# Altium project STM32F103ZET6最小系统V2.PrjPCB
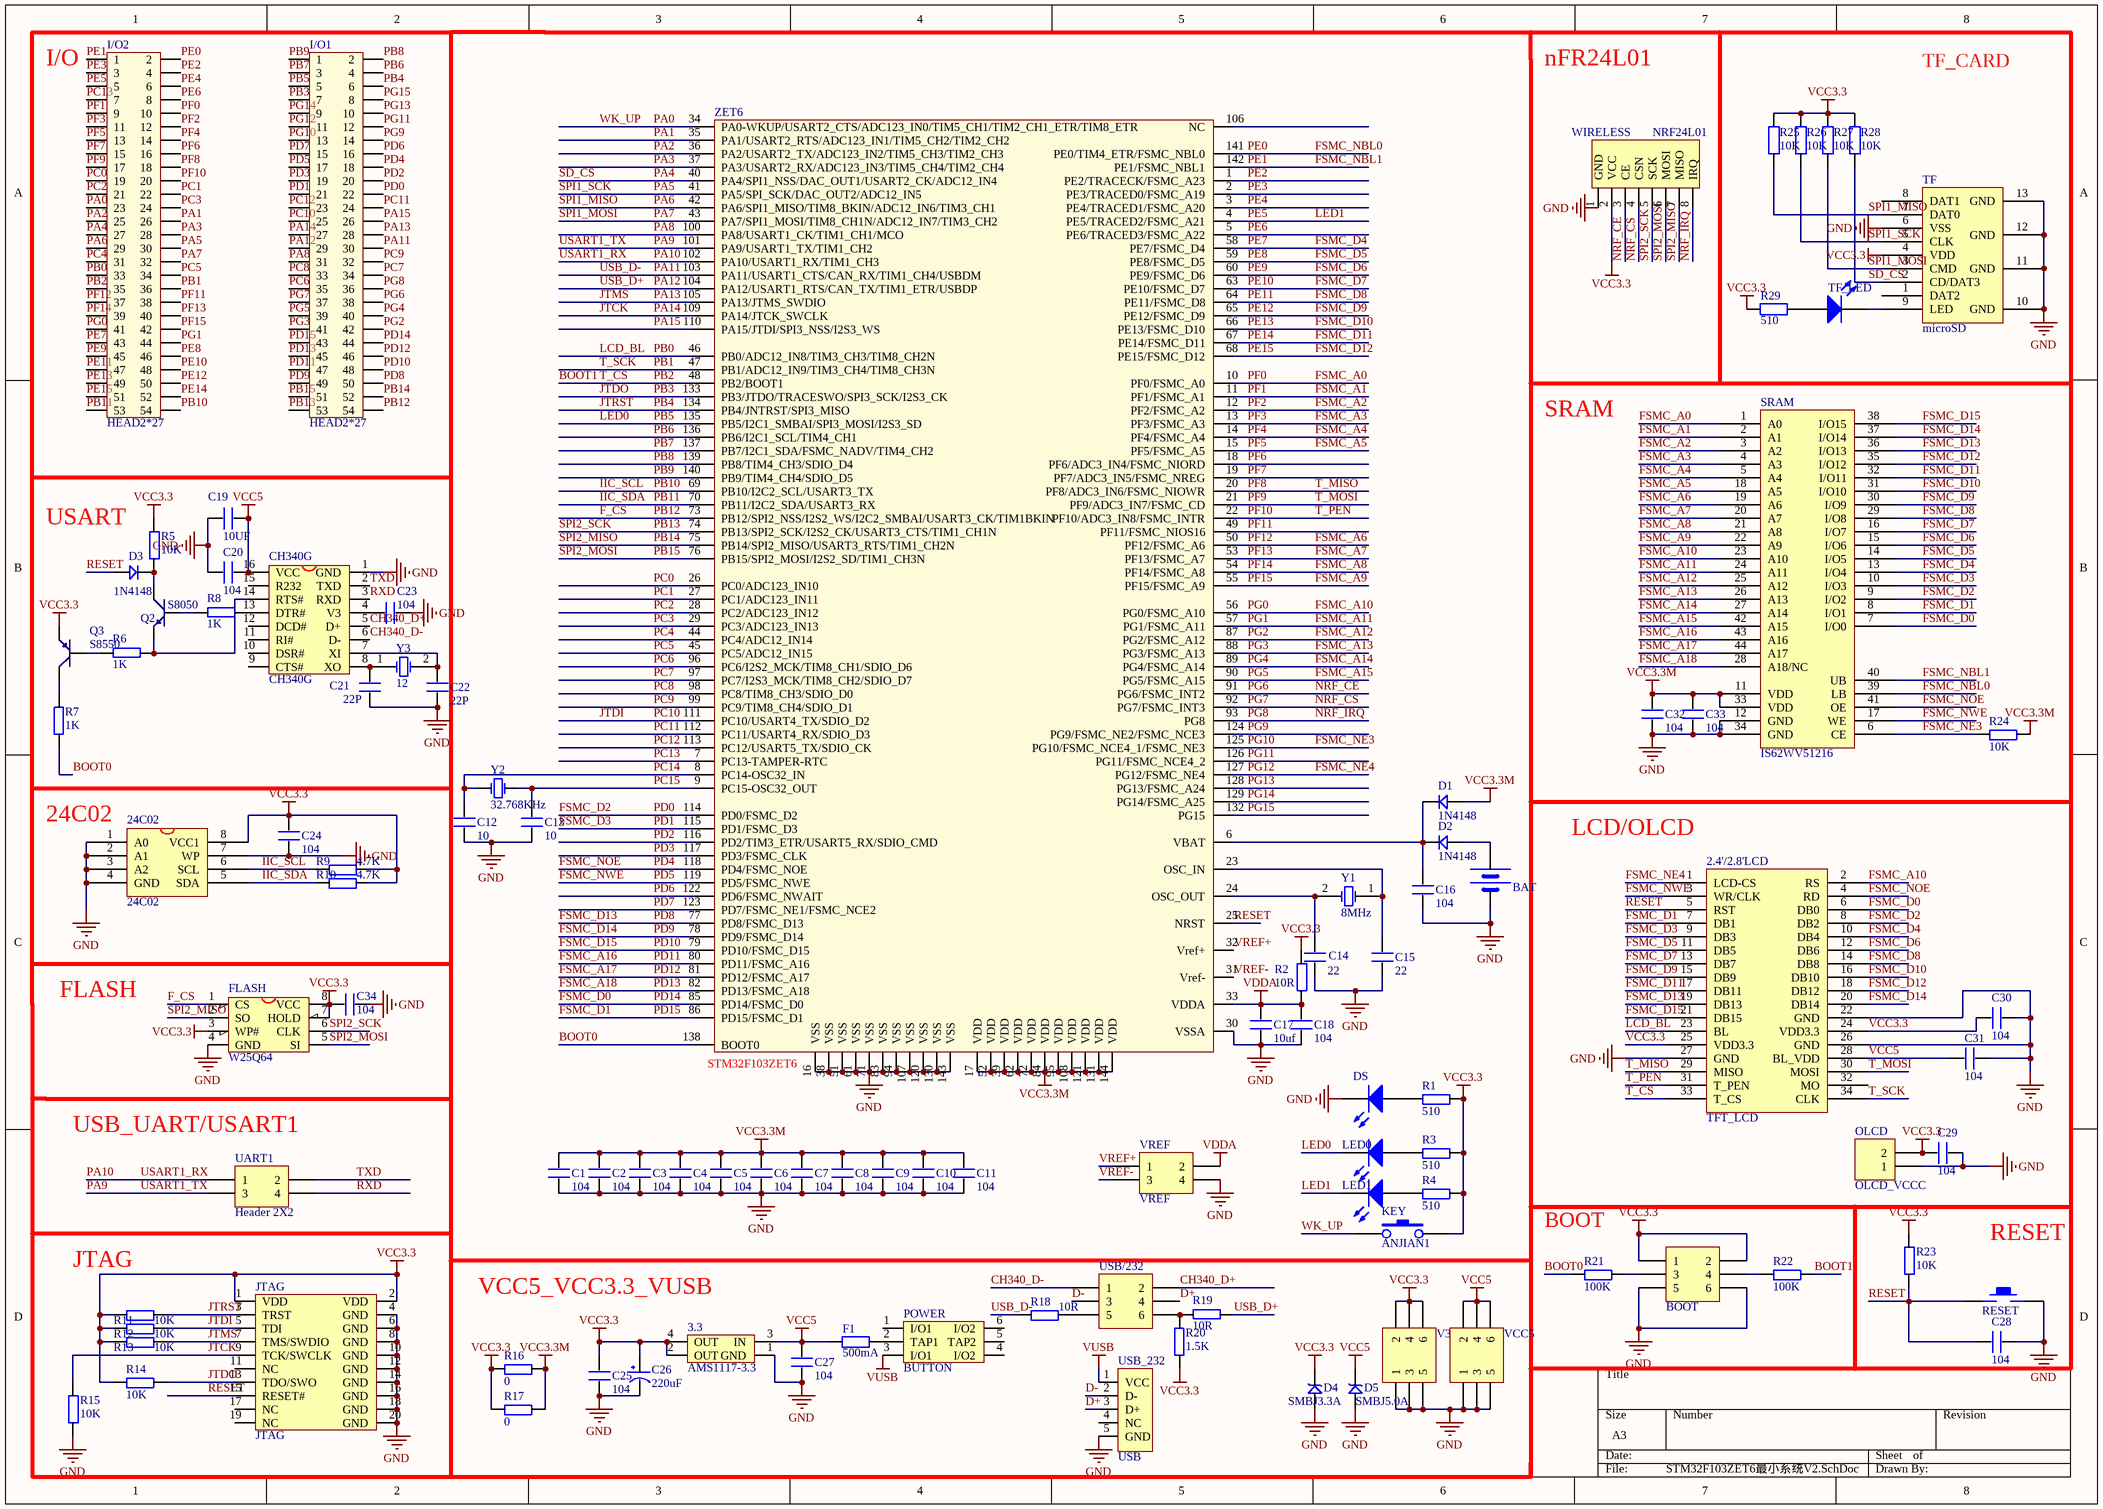
[diagram p0: STM32F103ZET6最小系统V2.SchDoc]
1 sheet, 102 parts. Net scope: global (net labels, ports and power ports of the same name join across sheets).
Board file: STM32F103ZET6最小系统V2.PcbDoc

## Sheet STM32F103ZET6最小系统V2.SchDoc
size A3

### Parts
2.4'/2.8'LCD  TFT_LCD  [DB2*17]
3.3  AMS1117-3.3  [AMS1117]
24C02  24C02  [SOP-8]
BAT  BATT  [BATM]  (value not drawn)
BOOT  Header 3X2  [HDR2X3]  (value not drawn)
C1  104  [0603P]
C2  104  [0603P]
C3  104  [0603P]
C4  104  [0603P]
C5  104  [0603P]
C6  104  [0603P]
C7  104  [0603P]
C8  104  [0603P]
C9  104  [0603P]
C10  104  [0603P]
C11  104  [0603P]
C12  10  [0603P]
C13  10  [0603P]
C14  22  [0805]
C15  22  [0805]
C16  104  [0805]
C17  10uf  [0805]
C18  104  [0603P]
C19  10UF  [0805]
C20  104  [0805]
C21  22P  [0805]
C22  22P  [0805]
C23  104  [0805]
C24  104  [0805]
C25  104  [0805]
C26  220uF  [CC6.56.5]
C27  104  [0805]
C28  104  [0805]
C29  104  [0805]
C30  104  [0805]
C31  104  [0805]
C32  104  [0805]
C33  104  [0805]
C34  104  [0805]
CH340G  CH340G  [SOP16M]
D1  1N4148  [DIODE_SOP]
D2  1N4148  [DIODE_SOP]
D3  1N4148  [DIODE_SOP]
D4  SMBJ5.0A  [SMBJ]
D5  SMBJ3.3A  [SMBJ]
DS  LED1  [0805]  (value not drawn)
F1  value 500mA  [0805]  (hidden comment: Res2)
FLASH  W25Q64  [SOIC-8]
I/O1  HEAD2*27  [HEAD2*27]
I/O2  HEAD2*27  [HEAD2*27]
JTAG  JTAG  [HDR2X10]
KEY  ANJIAN1  [贴片微动开关]
LED0  LED1  [0805]  (value not drawn)
LED1  LED1  [0805]  (value not drawn)
OLCD  OLCD_VCCC  [HDR1X2]
POWER  BUTTON  [BTN8.5*8.5]
Q2  S8050  [SOT-23R]
Q3  S8550  [SOT-23R]
R1  510  [0805]
R2  10R  [0805]
R3  510  [0805]
R4  510  [0805]
R5  10K  [0805]
R6  1K  [0805]
R7  1K  [0805]
R8  1K  [0805]
R9  4.7K  [0805]
R10  4.7K  [0805]
R11  10K  [0805]
R12  10K  [0805]
R13  10K  [0805]
R14  10K  [0805]
R15  10K  [0805]
R16  0  [0805]
R17  0  [0805]
R18  10R  [0805]
R19  10R  [0805]
R20  1.5K  [0805]
R21  100K  [0805]
R22  100K  [0805]
R23  10K  [0805]
R24  10K  [0805]
R25  value 10K  [0805]  (hidden comment: Res2)
R26  value 10K  [0805]  (hidden comment: Res2)
R27  value 10K  [0805]  (hidden comment: Res2)
R28  value 10K  [0805]  (hidden comment: Res2)
R29  value 510  [0805]  (hidden comment: Res2)
RESET  KEY_M  [贴片微动开关]  (value not drawn)
SRAM  IS62WV51216  [TSOP44]
TF  microSD  [TF_CARD]
TF_LED  LED1  [0805]  (value not drawn)
UART1  Header 2X2  [HDR2X2]
USB/232  Header 3X2  [HDR2X3]  (value not drawn)
USB_232  USB  [USB/SM0.8-6H5]
V3.3  Header 3X2  [HDR2X3]  (value not drawn)
VCC5  Header 3X2  [HDR2X3]  (value not drawn)
VREF  VREF  [HDR2X2]
WIRELESS  NRF24L01  [NRF24L01]
Y1  8MHz  [XTAL_US]
Y2  32.768KHz  [XTAL32]
Y3  12  [XTAL_US]
ZET6  STM32F103ZET6  [LQFP144]

### Nets
GND: 2.4'/2.8'LCD.22(GND) 2.4'/2.8'LCD.26(GND) 2.4'/2.8'LCD.27(GND) 3.3.1(GND) 24C02.1(A0) 24C02.2(A1) 24C02.3(A2) 24C02.4(GND) 24C02.7(WP) BAT.2(GND) BOOT.5 BOOT.6 C1.1 C2.1 C3.1 C4.1 C5.1 C6.1 C7.1 C8.1 C9.1 C10.1 C11.1 C12.1 C13.1 C14.1 C15.1 C16.1 C17.1 C18.1 C19.1 C20.1 C21.1 C22.1 C23.2 C24.1 C25.1 C26.2(GND) C27.1 C28.2 C29.1 C30.2 C31.2 C32.1 C33.1 C34.1 CH340G.1(GND) D4.1 D5.1 DS.2(K) FLASH.4(GND) JTAG.4(GND) JTAG.6(GND) JTAG.8(GND) JTAG.10(GND) JTAG.12(GND) JTAG.14(GND) JTAG.16(GND) JTAG.18(GND) JTAG.20(GND) OLCD.1 R15.1 RESET.2 SRAM.12(GND) SRAM.34(GND) TF.6(VSS) TF.10(GND) TF.11(GND) TF.12(GND) TF.13(GND) USB_232.5(GND) V3.3.1 V3.3.3 V3.3.5 VCC5.1 VCC5.3 VCC5.5 VREF.4 WIRELESS.1(GND) ZET6.16(VSS) ZET6.30(VSSA) ZET6.38(VSS) ZET6.51(VSS) ZET6.61(VSS) ZET6.71(VSS) ZET6.83(VSS) ZET6.94(VSS) ZET6.107(VSS) ZET6.120(VSS) ZET6.130(VSS) ZET6.143(VSS)
VCC3.3: 2.4'/2.8'LCD.24(VDD3.3) 2.4'/2.8'LCD.25(VDD3.3) 3.3.2(OUT) 3.3.4(OUT) 24C02.8(VCC1) BOOT.1 BOOT.2 C24.2 C25.2 C26.1(VCC) C29.2 C30.1 C34.2 D4.2 FLASH.3(WP#) FLASH.7(HOLD) FLASH.8(VCC) JTAG.1(VDD) JTAG.2(VDD) KEY.2 OLCD.2 Q3.1(E) R1.2 R2.2 R3.2 R4.2 R5.2 R9.2 R10.2 R11.1 R12.1 R13.1 R14.1 R16.1 R17.1 R20.2 R23.2 R25.2 R26.2 R27.2 R28.2 R29.2 TF.4(VDD) V3.3.2 V3.3.4 V3.3.6 WIRELESS.2(VCC)
VCC3.3M: C1.2 C2.2 C3.2 C4.2 C5.2 C6.2 C7.2 C8.2 C9.2 C10.2 C11.2 C32.2 C33.2 D1.1 R16.2 R17.2 R24.2 SRAM.11(VDD) SRAM.33(VDD) ZET6.17(VDD) ZET6.39(VDD) ZET6.52(VDD) ZET6.62(VDD) ZET6.72(VDD) ZET6.84(VDD) ZET6.95(VDD) ZET6.108(VDD) ZET6.121(VDD) ZET6.131(VDD) ZET6.144(VDD)
VCC5: 2.4'/2.8'LCD.28(BL_VDD) 3.3.3(IN) C19.2 C20.2 C27.2 C31.1 CH340G.16(VCC) D5.2 F1.1 VCC5.2 VCC5.4 VCC5.6
VDDA: C17.2 C18.2 R2.1 VREF.2 ZET6.33(VDDA)
VUSB: POWER.3(I/O1) USB_232.1(VCC)
BOOT0: R7.2 R21.1 ZET6.138(BOOT0)
BOOT1: 2.4'/2.8'LCD.33(T_CS) I/O2.35 R22.2 ZET6.48(PB2/BOOT1)  [also labelled PB2, T_CS]
CH340_D+: CH340G.5(D+) USB/232.2
CH340_D-: CH340G.6(D-) USB/232.1
D+: USB/232.4 USB_232.3(D+)
D-: USB/232.3 USB_232.2(D-)
F_CS: FLASH.1(CS) I/O1.54 ZET6.73(PB12/SPI2_NSS/I2S2_WS/I2C2_SMBAI/USART3_CK/TIM1BKIN)  [also labelled PB12]
FSMC_A0: I/O2.10 SRAM.1(A0) ZET6.10(PF0/FSMC_A0)  [also labelled PF0]
FSMC_A1: I/O2.9 SRAM.2(A1) ZET6.11(PF1/FSMC_A1)  [also labelled PF1]
FSMC_A2: I/O2.12 SRAM.3(A2) ZET6.12(PF2/FSMC_A2)  [also labelled PF2]
FSMC_A3: I/O2.11 SRAM.4(A3) ZET6.13(PF3/FSMC_A3)  [also labelled PF3]
FSMC_A4: I/O2.14 SRAM.5(A4) ZET6.14(PF4/FSMC_A4)  [also labelled PF4]
FSMC_A5: I/O2.13 SRAM.18(A5) ZET6.15(PF5/FSMC_A5)  [also labelled PF5]
FSMC_A6: I/O2.37 SRAM.19(A6) ZET6.50(PF12/FSMC_A6)  [also labelled PF12]
FSMC_A7: I/O2.40 SRAM.20(A7) ZET6.53(PF13/FSMC_A7)  [also labelled PF13]
FSMC_A8: I/O2.39 SRAM.21(A8) ZET6.54(PF14/FSMC_A8)  [also labelled PF14]
FSMC_A9: I/O2.42 SRAM.22(A9) ZET6.55(PF15/FSMC_A9)  [also labelled PF15]
FSMC_A10: 2.4'/2.8'LCD.2(RS) I/O2.41 SRAM.23(A10) ZET6.56(PG0/FSMC_A10)  [also labelled PG0]
FSMC_A11: I/O2.44 SRAM.24(A11) ZET6.57(PG1/FSMC_A11)  [also labelled PG1]
FSMC_A12: I/O1.42 SRAM.25(A12) ZET6.87(PG2/FSMC_A12)  [also labelled PG2]
FSMC_A13: I/O1.41 SRAM.26(A13) ZET6.88(PG3/FSMC_A13)  [also labelled PG3]
FSMC_A14: I/O1.40 SRAM.27(A14) ZET6.89(PG4/FSMC_A14)  [also labelled PG4]
FSMC_A15: I/O1.39 SRAM.42(A15) ZET6.90(PG5/FSMC_A15)  [also labelled PG5]
FSMC_A16: I/O1.47 SRAM.43(A16) ZET6.80(PD11/FSMC_A16)  [also labelled PD11]
FSMC_A17: I/O1.46 SRAM.44(A17) ZET6.81(PD12/FSMC_A17)  [also labelled PD12]
FSMC_A18: I/O1.45 SRAM.28(A18/NC) ZET6.82(PD13/FSMC_A18)  [also labelled PD13]
FSMC_D0: 2.4'/2.8'LCD.6(DB0) I/O1.44 SRAM.7(I/O0) ZET6.85(PD14/FSMC_D0)  [also labelled PD14]
FSMC_D1: 2.4'/2.8'LCD.7(DB1) I/O1.43 SRAM.8(I/O1) ZET6.86(PD15/FSMC_D1)  [also labelled PD15]
FSMC_D2: 2.4'/2.8'LCD.8(DB2) I/O1.22 SRAM.9(I/O2) ZET6.114(PD0/FSMC_D2)  [also labelled PD0]
FSMC_D3: 2.4'/2.8'LCD.9(DB3) I/O1.21 SRAM.10(I/O3) ZET6.115(PD1/FSMC_D3)  [also labelled PD1]
FSMC_D4: 2.4'/2.8'LCD.10(DB4) I/O2.43 SRAM.13(I/O4) ZET6.58(PE7/FSMC_D4)  [also labelled PE7]
FSMC_D5: 2.4'/2.8'LCD.11(DB5) I/O2.46 SRAM.14(I/O5) ZET6.59(PE8/FSMC_D5)  [also labelled PE8]
FSMC_D6: 2.4'/2.8'LCD.12(DB6) I/O2.45 SRAM.15(I/O6) ZET6.60(PE9/FSMC_D6)  [also labelled PE9]
FSMC_D7: 2.4'/2.8'LCD.13(DB7) I/O2.48 SRAM.16(I/O7) ZET6.63(PE10/FSMC_D7)  [also labelled PE10]
FSMC_D8: 2.4'/2.8'LCD.14(DB8) I/O2.47 SRAM.29(I/O8) ZET6.64(PE11/FSMC_D8)  [also labelled PE11]
FSMC_D9: 2.4'/2.8'LCD.15(DB9) I/O2.50 SRAM.30(I/O9) ZET6.65(PE12/FSMC_D9)  [also labelled PE12]
FSMC_D10: 2.4'/2.8'LCD.16(DB10) I/O2.49 SRAM.31(I/O10) ZET6.66(PE13/FSMC_D10)  [also labelled PE13]
FSMC_D11: 2.4'/2.8'LCD.17(DB11) I/O2.52 SRAM.32(I/O11) ZET6.67(PE14/FSMC_D11)  [also labelled PE14]
FSMC_D12: 2.4'/2.8'LCD.18(DB12) I/O2.51 SRAM.35(I/O12) ZET6.68(PE15/FSMC_D12)  [also labelled PE15]
FSMC_D13: 2.4'/2.8'LCD.19(DB13) I/O1.50 SRAM.36(I/O13) ZET6.77(PD8/FSMC_D13)  [also labelled PD8]
FSMC_D14: 2.4'/2.8'LCD.20(DB14) I/O1.49 SRAM.37(I/O14) ZET6.78(PD9/FSMC_D14)  [also labelled PD9]
FSMC_D15: 2.4'/2.8'LCD.21(DB15) I/O1.48 SRAM.38(I/O15) ZET6.79(PD10/FSMC_D15)  [also labelled PD10]
FSMC_NBL0: I/O2.2 SRAM.39(LB) ZET6.141(PE0/TIM4_ETR/FSMC_NBL0)  [also labelled PE0]
FSMC_NBL1: I/O2.1 SRAM.40(UB) ZET6.142(PE1/FSMC_NBL1)  [also labelled PE1]
FSMC_NE3: I/O1.13 R24.1 SRAM.6(CE) ZET6.125(PG10/FSMC_NCE4_1/FSMC_NE3)  [also labelled PG10]
FSMC_NE4: 2.4'/2.8'LCD.1(LCD-CS) I/O1.11 ZET6.127(PG12/FSMC_NE4)  [also labelled PG12]
FSMC_NOE: 2.4'/2.8'LCD.4(RD) I/O1.18 SRAM.41(OE) ZET6.118(PD4/FSMC_NOE)  [also labelled PD4]
FSMC_NWE: 2.4'/2.8'LCD.3(WR/CLK) I/O1.17 SRAM.17(WE) ZET6.119(PD5/FSMC_NWE)  [also labelled PD5]
IIC_SCL: 24C02.6(SCL) I/O2.54 R9.1 ZET6.69(PB10/I2C2_SCL/USART3_TX)  [also labelled PB10]
IIC_SDA: 24C02.5(SDA) I/O2.53 R10.1 ZET6.70(PB11/I2C2_SDA/USART3_RX)  [also labelled PB11]
JTCK: I/O1.27 JTAG.9(TCK/SWCLK) R15.2 ZET6.109(PA14/JTCK_SWCLK)  [also labelled PA14]
JTDI: I/O1.25 JTAG.5(TDI) R12.2 ZET6.111(PC10/USART4_TX/SDIO_D2)  [also labelled PC10]
JTDO: I/O1.7 JTAG.13(TDO/SWO) R14.2 ZET6.133(PB3/JTDO/TRACESWO/SPI3_SCK/I2S3_CK)  [also labelled PB3]
JTMS: I/O1.28 JTAG.7(TMS/SWDIO) R13.2 ZET6.105(PA13/JTMS_SWDIO)  [also labelled PA13]
JTRST: I/O1.6 JTAG.3(TRST) R11.2 ZET6.134(PB4/JNTRST/SPI3_MISO)  [also labelled PB4]
LCD_BL: 2.4'/2.8'LCD.23(BL) I/O2.33 ZET6.46(PB0/ADC12_IN8/TIM3_CH3/TIM8_CH2N)  [also labelled PB0]
LED0: I/O1.5 LED0.2(K) ZET6.135(PB5/I2C1_SMBAI/SPI3_MOSI/I2S3_SD)  [also labelled PB5]
LED1: I/O2.5 LED1.2(K) ZET6.4(PE5/TRACED2/FSMC_A21)  [also labelled PE5]
NRF_CE: I/O1.38 WIRELESS.3(CE) ZET6.91(PG6/FSMC_INT2)  [also labelled PG6]
NRF_CS: I/O1.37 WIRELESS.4(CSN) ZET6.92(PG7/FSMC_INT3)  [also labelled PG7]
NRF_IRQ: I/O1.36 WIRELESS.8(IRQ) ZET6.93(PG8)  [also labelled PG8]
PA0: I/O2.23 KEY.1 ZET6.34(PA0-WKUP/USART2_CTS/ADC123_IN0/TIM5_CH1/TIM2_CH1_ETR/TIM8_ETR)  [also labelled WK_UP]
PA1: I/O2.26 ZET6.35(PA1/USART2_RTS/ADC123_IN1/TIM5_CH2/TIM2_CH2)
PA2: I/O2.25 ZET6.36(PA2/USART2_TX/ADC123_IN2/TIM5_CH3/TIM2_CH3)
PA3: I/O2.28 ZET6.37(PA3/USART2_RX/ADC123_IN3/TIM5_CH4/TIM2_CH4)
PA4: I/O2.27 R28.1 TF.2(CD/DAT3) ZET6.40(PA4/SPI1_NSS/DAC_OUT1/USART2_CK/ADC12_IN4)  [also labelled SD_CS]
PA5: I/O2.30 R26.1 TF.5(CLK) ZET6.41(PA5/SPI_SCK/DAC_OUT2/ADC12_IN5)  [also labelled SPI1_SCK]
PA6: I/O2.29 R25.1 TF.7(DAT0) ZET6.42(PA6/SPI1_MISO/TIM8_BKIN/ADC12_IN6/TIM3_CH1)  [also labelled SPI1_MISO]
PA7: I/O2.32 R27.1 TF.3(CMD) ZET6.43(PA7/SPI1_MOSI/TIM8_CH1N/ADC12_IN7/TIM3_CH2)  [also labelled SPI1_MOSI]
PA8: I/O1.31 ZET6.100(PA8/USART1_CK/TIM1_CH1/MCO)
PA9: UART1.3 ZET6.101(PA9/USART1_TX/TIM1_CH2)  [also labelled USART1_TX]
PA10: UART1.1 ZET6.102(PA10/USART1_RX/TIM1_CH3)  [also labelled USART1_RX]
PA11: I/O1.30 R18.1 ZET6.103(PA11/USART1_CTS/CAN_RX/TIM1_CH4/USBDM)  [also labelled USB_D-]
PA12: I/O1.29 R19.1 ZET6.104(PA12/USART1_RTS/CAN_TX/TIM1_ETR/USBDP)  [also labelled USB_D+]
PA15: I/O1.26 ZET6.110(PA15/JTDI/SPI3_NSS/I2S3_WS)
PB1: 2.4'/2.8'LCD.34(CLK) I/O2.36 ZET6.47(PB1/ADC12_IN9/TIM3_CH4/TIM8_CH3N)  [also labelled T_SCK]
PB6: I/O1.4 ZET6.136(PB6/I2C1_SCL/TIM4_CH1)
PB7: I/O1.3 ZET6.137(PB7/I2C1_SDA/FSMC_NADV/TIM4_CH2)
PB8: I/O1.2 ZET6.139(PB8/TIM4_CH3/SDIO_D4)
PB9: I/O1.1 ZET6.140(PB9/TIM4_CH4/SDIO_D5)
PB13: FLASH.6(CLK) I/O1.53 WIRELESS.5(SCK) ZET6.74(PB13/SPI2_SCK/I2S2_CK/USART3_CTS/TIM1_CH1N)  [also labelled SPI2_SCK]
PB14: FLASH.2(SO) I/O1.52 WIRELESS.7(MISO) ZET6.75(PB14/SPI2_MISO/USART3_RTS/TIM1_CH2N)  [also labelled SPI2_MISO]
PB15: FLASH.5(SI) I/O1.51 WIRELESS.6(MOSI) ZET6.76(PB15/SPI2_MOSI/I2S2_SD/TIM1_CH3N)  [also labelled SPI2_MOSI]
PC0: I/O2.19 ZET6.26(PC0/ADC123_IN10)
PC1: I/O2.22 ZET6.27(PC1/ADC123_IN11)
PC2: I/O2.21 ZET6.28(PC2/ADC123_IN12)
PC3: I/O2.24 ZET6.29(PC3/ADC123_IN13)
PC4: I/O2.31 ZET6.44(PC4/ADC12_IN14)
PC5: I/O2.34 ZET6.45(PC5/ADC12_IN15)
PC6: I/O1.35 ZET6.96(PC6/I2S2_MCK/TIM8_CH1/SDIO_D6)
PC7: I/O1.34 ZET6.97(PC7/I2S3_MCK/TIM8_CH2/SDIO_D7)
PC8: I/O1.33 ZET6.98(PC8/TIM8_CH3/SDIO_D0)
PC9: I/O1.32 ZET6.99(PC9/TIM8_CH4/SDIO_D1)
PC11: I/O1.24 ZET6.112(PC11/USART4_RX/SDIO_D3)
PC12: I/O1.23 ZET6.113(PC12/USART5_TX/SDIO_CK)
PC13: I/O2.7 ZET6.7(PC13-TAMPER-RTC)
PC14: C12.2 Y2.2(OSC2) ZET6.8(PC14-OSC32_IN)
PC15: C13.2 Y2.1(OSC1) ZET6.9(PC15-OSC32_OUT)
PD2: I/O1.20 ZET6.116(PD2/TIM3_ETR/USART5_RX/SDIO_CMD)
PD3: I/O1.19 ZET6.117(PD3/FSMC_CLK)
PD6: I/O1.16 ZET6.122(PD6/FSMC_NWAIT)
PD7: I/O1.15 ZET6.123(PD7/FSMC_NE1/FSMC_NCE2)
PE2: I/O2.4 ZET6.1(PE2/TRACECK/FSMC_A23)
PE3: I/O2.3 ZET6.2(PE3/TRACED0/FSMC_A19)
PE4: I/O2.6 ZET6.3(PE4/TRACED1/FSMC_A20)
PE6: I/O2.8 ZET6.5(PE6/TRACED3/FSMC_A22)
PF6: I/O2.16 ZET6.18(PF6/ADC3_IN4/FSMC_NIORD)
PF7: I/O2.15 ZET6.19(PF7/ADC3_IN5/FSMC_NREG)
PF8: 2.4'/2.8'LCD.29(MISO) I/O2.18 ZET6.20(PF8/ADC3_IN6/FSMC_NIOWR)  [also labelled T_MISO]
PF9: 2.4'/2.8'LCD.30(MOSI) I/O2.17 ZET6.21(PF9/ADC3_IN7/FSMC_CD)  [also labelled T_MOSI]
PF10: 2.4'/2.8'LCD.31(T_PEN) I/O2.20 ZET6.22(PF10/ADC3_IN8/FSMC_INTR)  [also labelled T_PEN]
PF11: I/O2.38 ZET6.49(PF11/FSMC_NIOS16)
PG9: I/O1.14 ZET6.124(PG9/FSMC_NE2/FSMC_NCE3)
PG11: I/O1.12 ZET6.126(PG11/FSMC_NCE4_2)
PG13: I/O1.10 ZET6.128(PG13/FSMC_A24)
PG14: I/O1.9 ZET6.129(PG14/FSMC_A25)
PG15: I/O1.8 ZET6.132(PG15)
RESET: 2.4'/2.8'LCD.5(RST) C28.1 D3.1 JTAG.15(RESET#) R23.1 RESET.1 ZET6.25(NRST)
RXD: CH340G.3(RXD) UART1.4
TXD: CH340G.2(TXD) UART1.2
VREF+: VREF.1 ZET6.32(Vref+)
VREF-: VREF.3 ZET6.31(Vref-)
NetBAT_1: BAT.1(VCC) D2.1
NetBOOT_3: BOOT.3 R21.2
NetBOOT_4: BOOT.4 R22.1
NetC14_2: C14.2 Y1.2(OSC2) ZET6.24(OSC_OUT)
NetC15_2: C15.2 Y1.1(OSC1) ZET6.23(OSC_IN)
NetC16_2: C16.2 D1.2 D2.2 ZET6.6(VBAT)
NetC21_2: C21.2 CH340G.8(XO) Y3.1(OSC1)
NetC22_2: C22.2 CH340G.7(XI) Y3.2(OSC2)
NetC23_1: C23.1 CH340G.4(V3)
NetCH340G_13: CH340G.13(DTR#) R8.1
NetCH340G_14: CH340G.14(RTS#) Q2.1(E) R6.1
NetD3_2: D3.2 Q2.3(C) R5.1
NetDS_1: DS.1(A) R1.1
NetF1_2: F1.2 POWER.2(TAP1)
NetLED0_1: LED0.1(A) R3.1
NetLED1_1: LED1.1(A) R4.1
NetQ2_2: Q2.2(B) R8.2
NetQ3_2: Q3.2(B) R6.2
NetQ3_3: Q3.3(C) R7.1
NetR18_2: R18.2 USB/232.5
NetR19_2: R19.2 R20.1 USB/232.6
NetR29_1: R29.1 TF_LED.1(A)
NetTF_9: TF.9(LED) TF_LED.2(K)

Not connected (* = marked no-connect by the designer): 2.4'/2.8'LCD 32(MO); CH340G 9(CTS#) 10(DSR#) 11(RI#) 12(DCD#) 15(R232); JTAG 11(NC) 17(NC) 19(NC); POWER 1(I/O1) 4(I/O2) 5(TAP2) 6(I/O2); TF 1(DAT2) 8(DAT1); USB_232 4(NC); ZET6 106(NC)

### Notes on the sheet
- (near I/O2) I/O
- nFR24L01
- TF_CARD
- SRAM
- USART
- (near 24C02) 24C02
- LCD/OLCD
- FLASH
- (near UART1) USB_UART/USART1
- (near R21) BOOT
- RESET
- JTAG
- VCC5_VCC3.3_VUSB

### Library data of the parts
3.3 = AMS1117
24C02 = 24C256
BAT = BAT
BOOT USB/232 V3.3 VCC5 = Header 3X2: Header, 3-Pin, Dual row; LatestRevisionDate: 17-Jul-2002; LatestRevisionNote: Re-released for DXP Platform.; Publisher: Altium Limited
C1-C11 C27 C28 C30 C31 = C
C12 C13 C21 C22 = C_2
C14-C20 C23-C25 C29 C32-C34 = C_1
C26 = CAP
CH340G = CH340G: USB2UART
D1-D3 = D
D4 D5 = SMBJ: TVS
DS LED0 LED1 TF_LED = LED2: Typical RED, GREEN, YELLOW, AMBER GaAs LED; Published: 8-Jun-2000; LatestRevisionDate: 17-Jul-2002; LatestRevisionNote: Re-released for DXP Platform.; PackageDocument: Feb-2002; PackageReference: 3.2X1.6X1.1; Publisher: Altium Limited
F1 R25-R29 = Res2: Resistor; Published: 8-Jun-2000; LatestRevisionDate: 17-Jul-2002; LatestRevisionNote: Re-released for DXP Platform.; PackageReference: AXIAL-0.4; Publisher: Altium Limited; PackageDescription: Axial Device, Thru-Hole; 2 Leads; 0.4 in Pin Spacing
FLASH = W25X16: W25X16;SST25VF016;MX25L1605
OLCD = Header 2H: Header, 2-Pin, Right Angle; LatestRevisionDate: 17-Jul-2002; LatestRevisionNote: Re-released for DXP Platform.; Publisher: Altium Limited
Q2 = NPN: 8050/BCW846/BCW847
Q3 = PNP: 8550/BCW68
R1-R10 R16 R17 R24 = R
R11-R15 R21-R23 = R_1
R18-R20 = R_2
SRAM = SRAM
UART1 VREF = Header 2X2: Header, 2-Pin, Dual row; LatestRevisionDate: 17-Jul-2002; LatestRevisionNote: Re-released for DXP Platform.; Publisher: Altium Limited
USB_232 = USB5
Y1 Y3 = XTAL: Crystal Oscillator; Published: 8-Jun-2000; LatestRevisionDate: 17-Jul-2002; LatestRevisionNote: Re-released for DXP Platform.; Publisher: Altium Limited
Y2 = XTAL_3: 32.768K; Published: 8-Jun-2000; LatestRevisionDate: 17-Jul-2002; LatestRevisionNote: Re-released for DXP Platform.; Publisher: Altium Limited